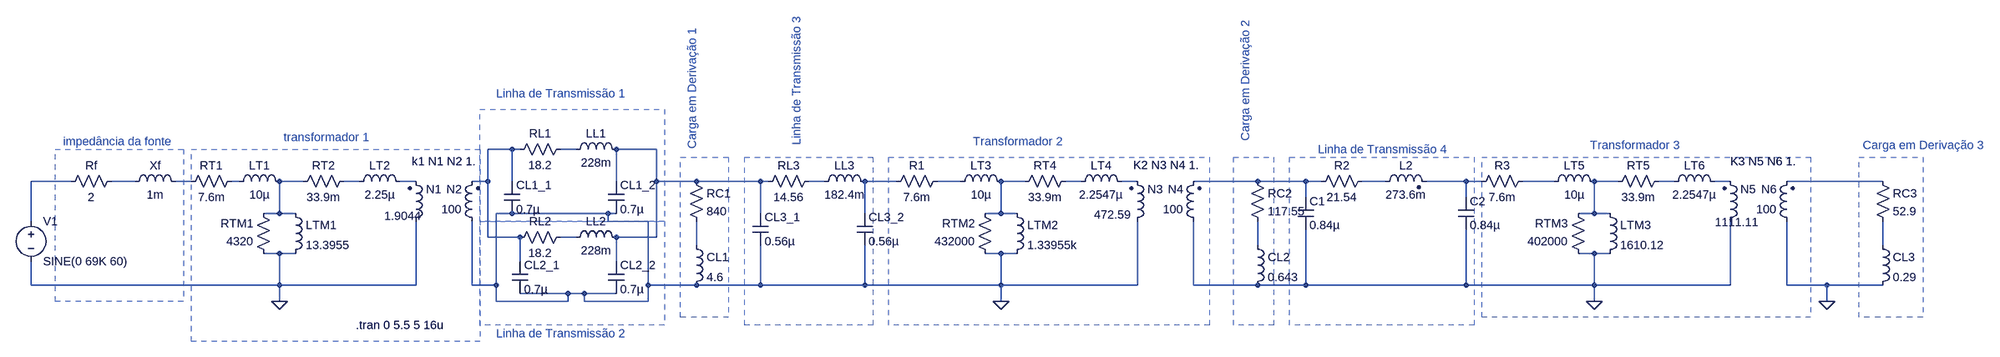
[diagram p0: schematic ryLtspice.asc]
ryLtspice.asc, the LTspice schematic file:
Version 4.1
SHEET 1 3720 680
WIRE 768 16 720 16
WIRE 784 16 768 16
WIRE 896 16 864 16
WIRE 1056 16 976 16
WIRE -112 80 -192 80
WIRE 16 80 -32 80
WIRE 128 80 96 80
WIRE 224 80 208 80
WIRE 352 80 304 80
WIRE 464 80 432 80
WIRE 576 80 544 80
WIRE 720 80 720 16
WIRE 720 80 688 80
WIRE 768 80 768 16
WIRE 976 80 976 16
WIRE 1056 80 1056 16
WIRE 1136 80 1056 80
WIRE 1264 80 1136 80
WIRE 1280 80 1264 80
WIRE 1392 80 1360 80
WIRE 1536 80 1472 80
WIRE 1664 80 1616 80
WIRE 1792 80 1744 80
WIRE 1904 80 1872 80
WIRE 2016 80 1984 80
WIRE 2256 80 2128 80
WIRE 2352 80 2256 80
WIRE 2384 80 2352 80
WIRE 2512 80 2464 80
WIRE 2672 80 2592 80
WIRE 2704 80 2672 80
WIRE 2848 80 2784 80
WIRE 2976 80 2928 80
WIRE 3088 80 3056 80
WIRE 3200 80 3168 80
WIRE 3504 80 3312 80
WIRE 2352 112 2352 80
WIRE 2672 112 2672 80
WIRE 304 144 304 80
WIRE 304 144 272 144
WIRE 336 144 304 144
WIRE 768 144 736 144
WIRE 960 144 768 144
WIRE 976 144 960 144
WIRE 1264 144 1264 80
WIRE 1472 144 1472 80
WIRE 1744 144 1744 80
WIRE 1744 144 1712 144
WIRE 1776 144 1744 144
WIRE 2928 144 2928 80
WIRE 2928 144 2896 144
WIRE 2960 144 2928 144
WIRE -192 160 -192 80
WIRE 960 160 960 144
WIRE 1040 160 960 160
WIRE 720 192 720 80
WIRE 784 192 720 192
WIRE 896 192 864 192
WIRE 1056 192 1056 80
WIRE 1056 192 976 192
WIRE 1136 208 1136 160
WIRE 2256 208 2256 160
WIRE 3504 208 3504 160
WIRE 304 224 272 224
WIRE 336 224 304 224
WIRE 1744 224 1712 224
WIRE 1776 224 1744 224
WIRE 2928 224 2896 224
WIRE 2960 224 2928 224
WIRE 784 240 784 192
WIRE 976 240 976 192
WIRE -192 288 -192 240
WIRE 304 288 304 224
WIRE 304 288 -192 288
WIRE 576 288 576 160
WIRE 576 288 304 288
WIRE 688 288 688 160
WIRE 736 288 736 144
WIRE 736 288 688 288
WIRE 1040 288 1040 160
WIRE 1136 288 1040 288
WIRE 1264 288 1264 208
WIRE 1264 288 1136 288
WIRE 1472 288 1472 208
WIRE 1472 288 1264 288
WIRE 1744 288 1744 224
WIRE 1744 288 1472 288
WIRE 2016 288 2016 160
WIRE 2016 288 1744 288
WIRE 2128 288 2128 160
WIRE 2256 288 2128 288
WIRE 2352 288 2352 176
WIRE 2352 288 2256 288
WIRE 2672 288 2672 176
WIRE 2672 288 2352 288
WIRE 2928 288 2928 224
WIRE 2928 288 2672 288
WIRE 3200 288 3200 160
WIRE 3200 288 2928 288
WIRE 3312 288 3312 160
WIRE 3392 288 3312 288
WIRE 3504 288 3392 288
WIRE 880 304 784 304
WIRE 912 304 880 304
WIRE 976 304 912 304
WIRE 304 320 304 288
WIRE 736 320 736 288
WIRE 880 320 880 304
WIRE 880 320 736 320
WIRE 912 320 912 304
WIRE 1040 320 1040 288
WIRE 1040 320 912 320
WIRE 1744 320 1744 288
WIRE 2928 320 2928 288
WIRE 3392 320 3392 288
FLAG 304 320 0
FLAG 1744 320 0
FLAG 2928 320 0
FLAG 3392 320 0
DATAFLAG 2016 256 ""
SYMBOL voltage -192 144 R0
WINDOW 123 0 0 Left 0
WINDOW 39 24 124 Left 2
SYMATTR InstName V1
SYMATTR Value SINE(0 69K 60)
SYMBOL res -16 64 R90
WINDOW 0 0 56 VBottom 2
WINDOW 3 32 56 VTop 2
SYMATTR InstName Rf
SYMATTR Value 2
SYMBOL ind 0 96 R270
WINDOW 0 32 56 VTop 2
WINDOW 3 5 56 VBottom 2
SYMATTR InstName Xf
SYMATTR Value 1m
SYMBOL res 224 64 R90
WINDOW 0 0 56 VBottom 2
WINDOW 3 32 56 VTop 2
SYMATTR InstName RT1
SYMATTR Value 7.6m
SYMBOL res 448 64 R90
WINDOW 0 0 56 VBottom 2
WINDOW 3 32 56 VTop 2
SYMATTR InstName RT2
SYMATTR Value 33.9m
SYMBOL res 288 240 R180
WINDOW 0 36 76 Left 2
WINDOW 3 36 40 Left 2
SYMATTR InstName RTM1
SYMATTR Value 4320
SYMBOL ind 320 128 R0
SYMATTR InstName LTM1
SYMATTR Value 13.3955
SYMBOL ind 208 96 R270
WINDOW 0 32 56 VTop 2
WINDOW 3 5 56 VBottom 2
SYMATTR InstName LT1
SYMATTR Value 10µ
SYMBOL ind 448 96 R270
WINDOW 0 32 56 VTop 2
WINDOW 3 5 56 VBottom 2
SYMATTR InstName LT2
SYMATTR Value 2.25µ
SYMBOL ind2 560 176 M180
WINDOW 0 36 80 Left 2
WINDOW 3 -47 27 Left 2
SYMATTR InstName N1
SYMATTR Value 1.9044
SYMBOL ind2 704 176 R180
WINDOW 0 36 80 Left 2
WINDOW 3 36 40 Left 2
SYMATTR InstName N2
SYMATTR Value 100
SYMBOL res 880 0 R90
WINDOW 0 0 56 VBottom 2
WINDOW 3 32 56 VTop 2
SYMATTR InstName RL1
SYMATTR Value 18.2
SYMBOL ind 880 32 R270
WINDOW 0 32 56 VTop 2
WINDOW 3 5 56 VBottom 2
SYMATTR InstName LL1
SYMATTR Value 228m
SYMBOL cap 752 80 R0
SYMATTR InstName CL1_1
SYMATTR Value 0.7µ
SYMBOL cap 960 80 R0
SYMATTR InstName CL1_2
SYMATTR Value 0.7µ
SYMBOL res 768 208 R270
WINDOW 0 32 56 VTop 2
WINDOW 3 0 56 VBottom 2
SYMATTR InstName RL2
SYMATTR Value 18.2
SYMBOL ind 880 208 R270
WINDOW 0 32 56 VTop 2
WINDOW 3 5 56 VBottom 2
SYMATTR InstName LL2
SYMATTR Value 228m
SYMBOL cap 768 240 R0
SYMATTR InstName CL2_1
SYMATTR Value 0.7µ
SYMBOL cap 960 240 R0
SYMATTR InstName CL2_2
SYMATTR Value 0.7µ
SYMBOL res 1120 64 R0
SYMATTR InstName RC1
SYMATTR Value 840
SYMBOL ind 1120 192 R0
SYMATTR InstName CL1
SYMATTR Value 4.6
SYMBOL res 1376 64 R90
WINDOW 0 0 56 VBottom 2
WINDOW 3 32 56 VTop 2
SYMATTR InstName RL3
SYMATTR Value 14.56
SYMBOL ind 1376 96 R270
WINDOW 0 32 56 VTop 2
WINDOW 3 5 56 VBottom 2
SYMATTR InstName LL3
SYMATTR Value 182.4m
SYMBOL cap 1248 144 R0
SYMATTR InstName CL3_1
SYMATTR Value 0.56µ
SYMBOL cap 1456 144 R0
SYMATTR InstName CL3_2
SYMATTR Value 0.56µ
SYMBOL res 1888 64 R90
WINDOW 0 0 56 VBottom 2
WINDOW 3 32 56 VTop 2
SYMATTR InstName RT4
SYMATTR Value 33.9m
SYMBOL res 1728 240 R180
WINDOW 0 36 76 Left 2
WINDOW 3 36 40 Left 2
SYMATTR InstName RTM2
SYMATTR Value 432000
SYMBOL ind 1760 128 R0
SYMATTR InstName LTM2
SYMATTR Value 1.33955k
SYMBOL ind 1648 96 R270
WINDOW 0 32 56 VTop 2
WINDOW 3 5 56 VBottom 2
SYMATTR InstName LT3
SYMATTR Value 10µ
SYMBOL ind 1888 96 R270
WINDOW 0 32 56 VTop 2
WINDOW 3 5 56 VBottom 2
SYMATTR InstName LT4
SYMATTR Value 2.2547µ
SYMBOL ind2 2000 176 M180
WINDOW 0 36 80 Left 2
WINDOW 3 -70 29 Left 2
SYMATTR InstName N3
SYMATTR Value 472.59
SYMBOL ind2 2144 176 R180
WINDOW 0 36 80 Left 2
WINDOW 3 36 40 Left 2
SYMATTR InstName N4
SYMATTR Value 100
SYMBOL cap 2336 112 R0
SYMATTR InstName C1
SYMATTR Value 0.84µ
SYMBOL res 2480 64 R90
WINDOW 0 0 56 VBottom 2
WINDOW 3 32 56 VTop 2
SYMATTR InstName R2
SYMATTR Value 21.54
SYMBOL ind2 2496 96 R270
WINDOW 0 32 56 VTop 2
WINDOW 3 5 56 VBottom 2
SYMATTR InstName L2
SYMATTR Value 273.6m
SYMATTR Type ind
SYMBOL cap 2656 112 R0
SYMATTR InstName C2
SYMATTR Value 0.84µ
SYMBOL res 2240 64 R0
SYMATTR InstName RC2
SYMATTR Value 117.55
SYMBOL ind 2240 192 R0
SYMATTR InstName CL2
SYMATTR Value 0.643
SYMBOL res 3072 64 R90
WINDOW 0 0 56 VBottom 2
WINDOW 3 32 56 VTop 2
SYMATTR InstName RT5
SYMATTR Value 33.9m
SYMBOL res 2912 240 R180
WINDOW 0 36 76 Left 2
WINDOW 3 36 40 Left 2
SYMATTR InstName RTM3
SYMATTR Value 402000
SYMBOL ind 2944 128 R0
SYMATTR InstName LTM3
SYMATTR Value 1610.12
SYMBOL ind 2832 96 R270
WINDOW 0 32 56 VTop 2
WINDOW 3 5 56 VBottom 2
SYMATTR InstName LT5
SYMATTR Value 10µ
SYMBOL ind 3072 96 R270
WINDOW 0 32 56 VTop 2
WINDOW 3 5 56 VBottom 2
SYMATTR InstName LT6
SYMATTR Value 2.2547µ
SYMBOL ind2 3184 176 M180
WINDOW 0 36 80 Left 2
WINDOW 3 -15 14 Left 2
SYMATTR InstName N5
SYMATTR Value 1111.11
SYMBOL res 2800 64 R90
WINDOW 0 0 56 VBottom 2
WINDOW 3 32 56 VTop 2
SYMATTR InstName R3
SYMATTR Value 7.6m
SYMBOL res 3488 64 R0
SYMATTR InstName RC3
SYMATTR Value 52.9
SYMBOL ind 3488 192 R0
SYMATTR InstName CL3
SYMATTR Value 0.29
SYMBOL ind2 3328 176 R180
WINDOW 0 36 80 Left 2
WINDOW 3 36 40 Left 2
SYMATTR InstName N6
SYMATTR Value 100
SYMBOL res 1632 64 R90
WINDOW 0 0 56 VBottom 2
WINDOW 3 32 56 VTop 2
SYMATTR InstName R1
SYMATTR Value 7.6m
TEXT 456 368 Left 2 !.tran 0 5.5 5 16u
TEXT 568 40 Left 2 !k1 N1 N2 1.
TEXT 2008 48 Left 2 !K2 N3 N4 1.
TEXT 3200 40 Left 2 !K3 N5 N6 1.
TEXT 312 -8 Left 2 ;transformador 1
TEXT -128 0 Left 2 ;impedância da fonte
TEXT 736 -96 Left 2 ;Linha de Transmissão 1
TEXT 736 384 Left 2 ;Linha de Transmissão 2
TEXT 1128 16 VLeft 2 ;Carga em Derivação 1
TEXT 1336 8 VLeft 2 ;Linha de Transmissão 3
TEXT 1688 0 Left 2 ;Transformador 2
TEXT 2232 0 VLeft 2 ;Carga em Derivação 2
TEXT 2376 16 Left 2 ;Linha de Transmissão 4
TEXT 2920 8 Left 2 ;Transformador 3
TEXT 3464 8 Left 2 ;Carga em Derivação 3
RECTANGLE Normal 1072 160 704 -64 2
RECTANGLE Normal 1072 368 704 160 2
RECTANGLE Normal 112 320 -144 16 2
RECTANGLE Normal 704 400 128 16 2
RECTANGLE Normal 1200 352 1104 32 2
RECTANGLE Normal 1488 368 1232 32 2
RECTANGLE Normal 2160 368 1520 32 2
RECTANGLE Normal 2288 368 2208 32 2
RECTANGLE Normal 2688 368 2320 32 2
RECTANGLE Normal 3360 352 2704 32 2
RECTANGLE Normal 3584 352 3456 32 2

The netlist it stands for:
* ryLtspice.asc
V1 N004 0 SINE(0 69K 60)
Rf N005 N004 2
L§Xf N005 N006 1m
RT1 N007 N006 7.6m
RT2 N009 N008 33.9m
RTM1 0 N008 4320
LTM1 N008 0 13.3955
LT1 N007 N008 10µ
LT2 N009 N010 2.25µ
L§N1 0 N010 1.9044
L§N2 0 N001 100
RL1 N002 N001 18.2
LL1 N002 N003 228m
CL1_1 N001 0 0.7µ
CL1_2 N003 0 0.7µ
RL2 N001 N025 18.2
LL2 N025 N003 228m
CL2_1 N001 0 0.7µ
CL2_2 N003 0 0.7µ
RC1 N003 N026 840
L§CL1 N026 0 4.6
RL3 N011 N003 14.56
LL3 N011 N012 182.4m
CL3_1 N003 0 0.56µ
CL3_2 N012 0 0.56µ
RT4 N015 N014 33.9m
RTM2 0 N014 432000
LTM2 N014 0 1.33955k
LT3 N013 N014 10µ
LT4 N015 N016 2.2547µ
L§N3 0 N016 472.59
L§N4 0 N017 100
C1 N017 0 0.84µ
R2 N018 N017 21.54
L2 N018 N019 273.6m
C2 N019 0 0.84µ
RC2 N017 N027 117.55
L§CL2 N027 0 0.643
RT5 N022 N021 33.9m
RTM3 0 N021 402000
LTM3 N021 0 1610.12
LT5 N020 N021 10µ
LT6 N022 N023 2.2547µ
L§N5 0 N023 1111.11
R3 N020 N019 7.6m
RC3 N024 N028 52.9
L§CL3 N028 0 0.29
L§N6 0 N024 100
R1 N013 N012 7.6m
.tran 0 5.5 5 16u
k1 N1 N2 1.
K2 N3 N4 1.
K3 N5 N6 1.
* transformador 1
* impedância da fonte
* Linha de Transmissão 1
* Linha de Transmissão 2
* Carga em Derivação 1
* Linha de Transmissão 3
* Transformador 2
* Carga em Derivação 2
* Linha de Transmissão 4
* Transformador 3
* Carga em Derivação 3
.backanno
.end